# Altium project 6S_4V-8V_OS3_V4.PrjPcb
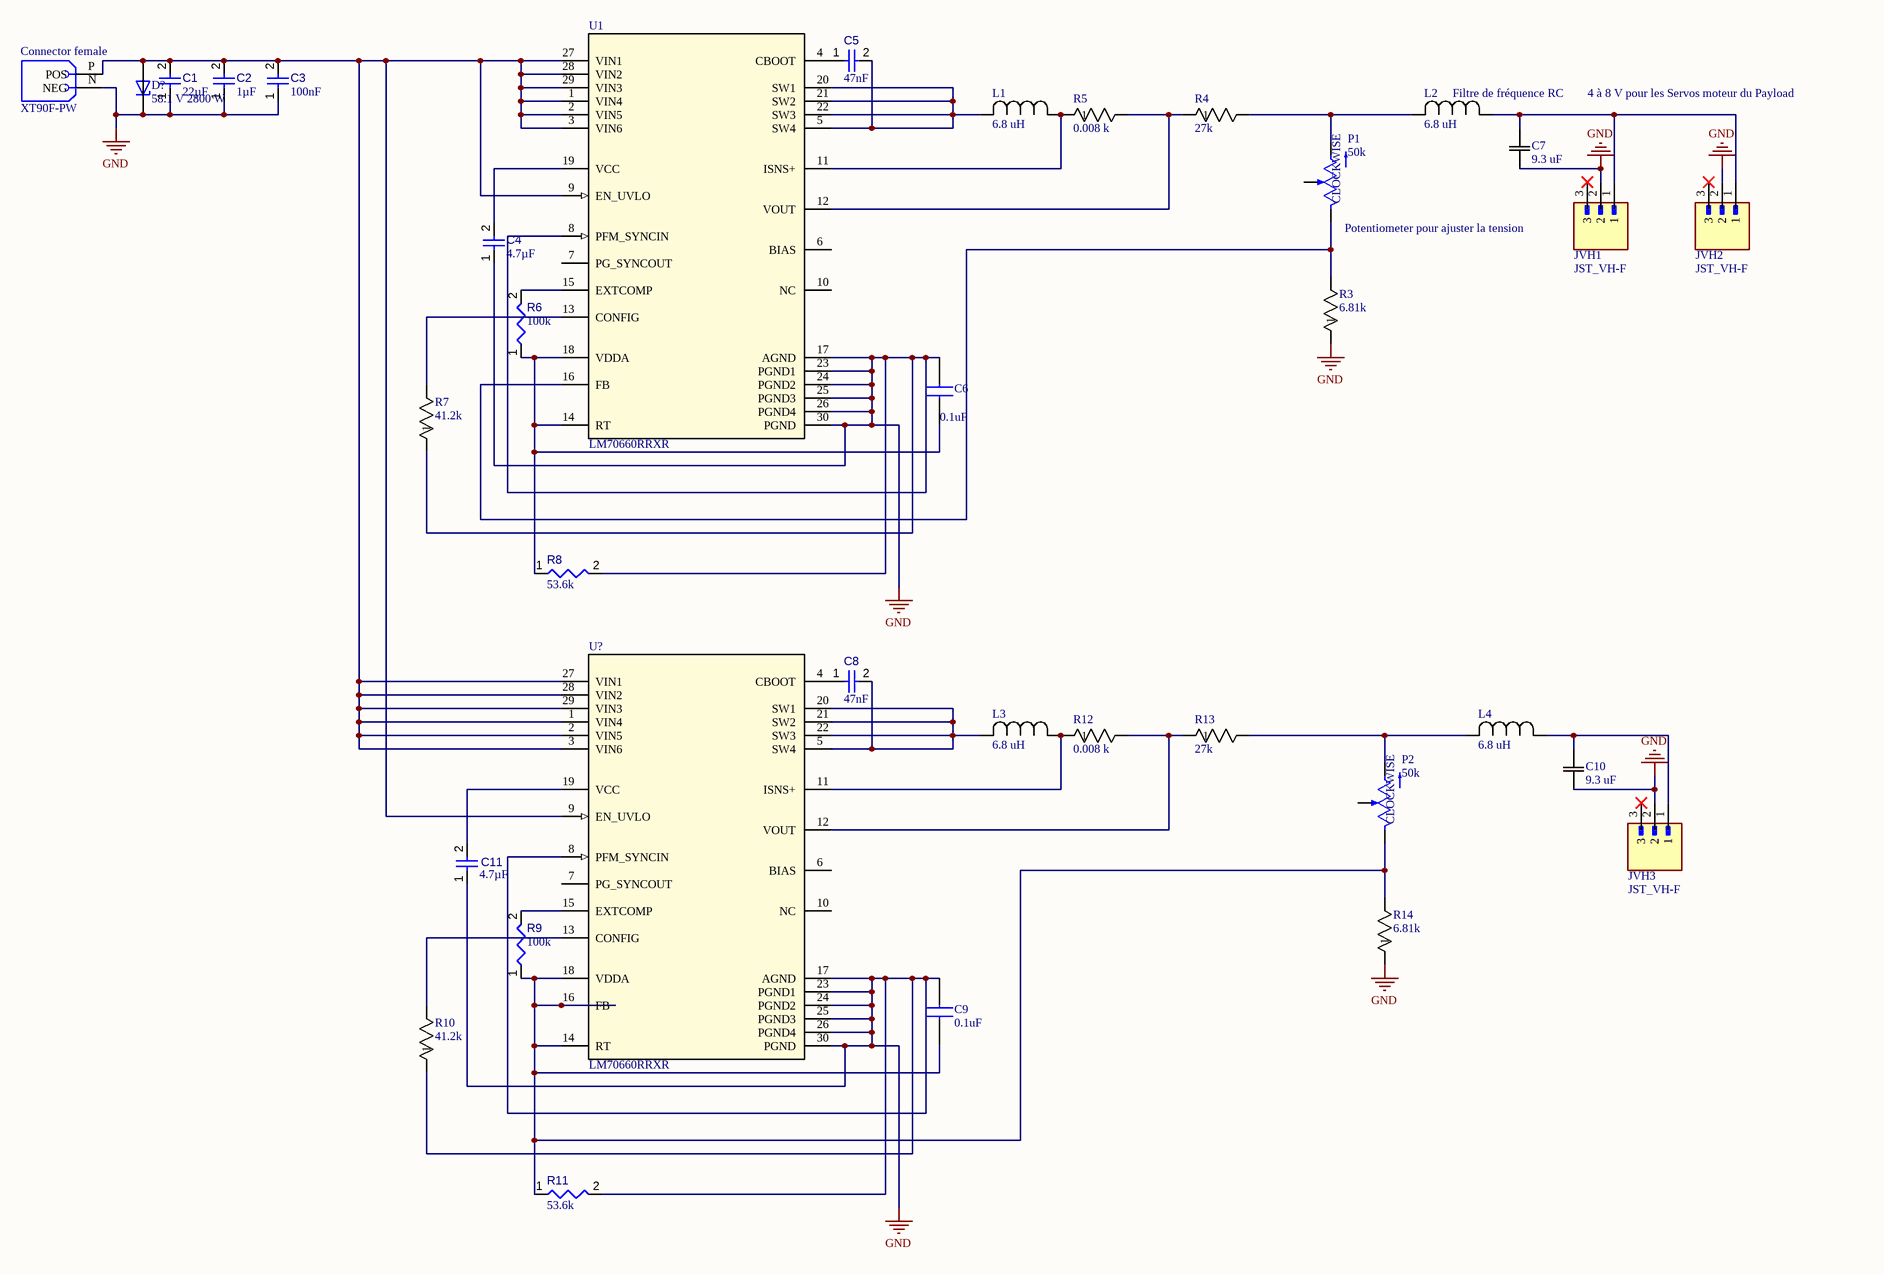
[diagram p0: 6S_4V-8V_OS3_V4.SchDoc]
1 sheet, 36 parts. Net scope: global (net labels, ports and power ports of the same name join across sheets).
Board file: PCB1.PcbDoc

## Sheet 6S_4V-8V_OS3_V4.SchDoc
size A2; SheetNumber: 1; SheetTotal: 1

### Parts
C1  value 22µF  [CAPC0805(2012)145_L]  (hidden comment: Capacitor 22µF +/-40% 16V 0805)
C2  value 1µF  [CAPC1608X94X35NL15T15]  (hidden comment: Capacitor 1 uF +/- 10% 16 V 0603)
C3  value 100nF  [CAPC1608X90X40NL10T20]  (hidden comment: Capacitor 100 nF +/-10% 50 V 0603)
C4  value 4.7µF  [CAPC0805(2012)145_L]  (hidden comment: Capacitor 4.7µF +/-40% 25V 0805)
C5  value 47nF  [CAPC0402(1005)60_L]  (hidden comment: Capacitor 47nF +/-20% 50V 0402)
C6  0.1uF  [CAPC2012X145N]
C7  9.3 uF  [CAP_1812C_X7R_2S_50V_KEM]
C8  value 47nF  [CAPC0402(1005)60_L]  (hidden comment: Capacitor 47nF +/-20% 50V 0402)
C9  0.1uF  [CAPC2012X145N]
C10  9.3 uF  [CAP_1812C_X7R_2S_50V_KEM]
C11  value 4.7µF  [CAPC0805(2012)145_L]  (hidden comment: Capacitor 4.7µF +/-40% 25V 0805)
Connector_female  XT90F-PW  [AMASS_XT90PW-F]
D?  58.1 V 2800 W  [TVSP_TLD8S36AH]
JVH1  JST_VH-F  [JST_B3P-VH(LF)(SN)]
JVH2  JST_VH-F  [JST_B3P-VH(LF)(SN)]
JVH3  JST_VH-F  [JST_B3P-VH(LF)(SN)]
L1  6.8 uH  [IND_IHLP-4040DZ_VIS]
L2  6.8 uH  [IND_IHLP-4040DZ_VIS]
L3  6.8 uH  [IND_IHLP-4040DZ_VIS]
L4  6.8 uH  [IND_IHLP-4040DZ_VIS]
P1  50k  [TRIM_3361P-1-503GLF]
P2  50k  [TRIM_3361P-1-503GLF]
R3  6.81k  [RES_MFR25_6P3X2P4_YAG]
R4  27k  [STA_CF18_STP]
R5  0.008 k  [STA_CF18_STP]
R6  value 100k  [RESC1005X40X25ML05T05]  (hidden comment: Resistor 100k +/-1% 0402 100 mW)
R7  41.2k  [YAG_MF25_YAG]
R8  value 53.6k  [RESC0402(1005)_L]  (hidden comment: Resistor 53K6 +/-1 % 0402 63 mW)
R9  value 100k  [RESC1005X40X25ML05T05]  (hidden comment: Resistor 100k +/-1% 0402 100 mW)
R10  41.2k  [YAG_MF25_YAG]
R11  value 53.6k  [RESC0402(1005)_L]  (hidden comment: Resistor 53K6 +/-1 % 0402 63 mW)
R12  0.008 k  [STA_CF18_STP]
R13  27k  [STA_CF18_STP]
R14  6.81k  [RES_MFR25_6P3X2P4_YAG]
U1  LM70660RRXR  [RRX0029B-MFG]
U?  LM70660RRXR  [RRX0029B-MFG]

### Nets
GND: C1.1 C2.1 C3.1 C4.1 C6.2 C7.1 C9.2 C10.1 C11.1 Connector_female.N(NEG) D?.C JVH1.2 JVH2.2 JVH3.2 R3.1 R7.1 R8.2 R10.1 R11.2 R14.1 U1.8(PFM_SYNCIN) U1.17(AGND) U1.23(PGND1) U1.24(PGND2) U1.25(PGND3) U1.26(PGND4) U1.30(PGND) U?.8(PFM_SYNCIN) U?.17(AGND) U?.23(PGND1) U?.24(PGND2) U?.25(PGND3) U?.26(PGND4) U?.30(PGND)
NetC1_2: C1.2 C2.2 C3.2 Connector_female.P(POS) D?.A U1.1(VIN4) U1.2(VIN5) U1.3(VIN6) U1.9(EN_UVLO) U1.27(VIN1) U1.28(VIN2) U1.29(VIN3) U?.1(VIN4) U?.2(VIN5) U?.3(VIN6) U?.9(EN_UVLO) U?.27(VIN1) U?.28(VIN2) U?.29(VIN3)
NetC4_2: C4.2 U1.19(VCC)
NetC5_1: C5.1 U1.4(CBOOT)
NetC5_2: C5.2 L1.2 U1.5(SW4) U1.20(SW1) U1.21(SW2) U1.22(SW3)
NetC6_1: C6.1 R6.1 R8.1 U1.14(RT) U1.18(VDDA)
NetC7_2: C7.2 JVH1.1 JVH2.1 L2.1
NetC8_1: C8.1 U?.4(CBOOT)
NetC8_2: C8.2 L3.2 U?.5(SW4) U?.20(SW1) U?.21(SW2) U?.22(SW3)
NetC9_1: C9.1 P2.1(CCW) R9.1 R11.1 R14.2 U?.14(RT) U?.16(FB) U?.18(VDDA)
NetC10_2: C10.2 JVH3.1 L4.1
NetC11_2: C11.2 U?.19(VCC)
NetL1_1: L1.1 R5.1 U1.11(ISNS+)
NetL2_2: L2.2 P1.3(CW) R4.2
NetL3_1: L3.1 R12.1 U?.11(ISNS+)
NetL4_2: L4.2 P2.3(CW) R13.2
NetP1_1: P1.1(CCW) R3.2 U1.16(FB)
NetR4_1: R4.1 R5.2 U1.12(VOUT)
NetR6_2: R6.2 U1.15(EXTCOMP)
NetR7_2: R7.2 U1.13(CONFIG)
NetR9_2: R9.2 U?.15(EXTCOMP)
NetR10_2: R10.2 U?.13(CONFIG)
NetR12_2: R12.2 R13.1 U?.12(VOUT)

Not connected (* = marked no-connect by the designer): JVH1 3*; JVH2 3*; JVH3 3*; P1 2(WIPER); P2 2(WIPER); U1 6(BIAS) 7(PG_SYNCOUT) 10(NC); U? 6(BIAS) 7(PG_SYNCOUT) 10(NC)

### Notes on the sheet
- (near L2) Filtre de fréquence RC
- 4 à 8 V pour les Servos moteur du Payload
- Potentiometer pour ajuster la tension
- (in symbol TRIM_3361P-1-503GLF) CLOCKWISE

### Library data of the parts
C1 = CMP-001-00081-4: Chip Capacitor, 22µF +/-40%, 16V, 0805, Thickness 1.45 mm; Tolerance: 5%; Voltage Rating: 16V; Mounting Technology: SMT; Pins: 2; Max Operating Temperature: 85°C; Case/Package: 0805; Min Operating Temperature: -55°C
C2 = CMP-001-00003-6: Chip Capacitor, 1 uF, +/- 10%, 16 V, 0603 (1608 Metric); Voltage Rating: 16V; Capacitor Type: Ceramic; Max Operating Temperature: 125°C; Pins: 2; Tolerance: 10%; Min Operating Temperature: -55°C; RoHS Compliant: True; Mounting Technology: SM; Case/Package: 0603
C3 = CMP-001-00017-6: Chip Capacitor, 100 nF, +/- 10%, 50 V, 0603 (1608 Metric); Voltage Rating: 50V; Capacitor Type: Ceramic; Tolerance: 10%; Mounting Technology: SM; Max Operating Temperature: 125°C; RoHS Compliant: True; Pins: 2; Case/Package: 0603; Min Operating Temperature: -55°C
C4 C11 = CMP-001-00080-4: Chip Capacitor, 4.7µF +/-40%, 25V, 0805, Thickness 1.45 mm; Tolerance: 20%; Voltage Rating: 25V; Min Operating Temperature: -55°C; Max Operating Temperature: 85°C; Pins: 2; Mounting Technology: SMT; Case/Package: 0805
C5 C8 = CMP-001-00071-4: Chip Capacitor, 47nF +/-20%, 50V, 0402, Thickness 0.6 mm; Tolerance: 20%; Pins: 2; Mounting Technology: SMT; Voltage Rating: 50V; Case/Package: 0402; Max Operating Temperature: 85°C; Min Operating Temperature: -55°C
C6 C9 = C2012X7R2A104K125AA: Capacitor; Manufacturer_Name: TDK; Datasheet Link: https://product.tdk.com/info/en/catalog/datasheets/mlcc_commercial_midvoltage_en.pdf; Height: 1.45mm; Manufacturer_Part_Number: C2012X7R2A104K125AA; Mouser Part Number: 810-C2012X7R2A104K; Mouser Price/Stock: https://www.mouser.co.uk/ProductDetail/TDK/C2012X7R2A104K125AA?qs=NRhsANhppD9J0ZsT2%2Fo%2F7Q%3D%3D; Arrow Part Number: C2012X7R2A104K125AA; Arrow Price/Stock: https://www.arrow.com/en/products/c2012x7r2a104k125aa/tdk?region=europe; ClassName: PowerModul
C7 C10 = CAP_1812C_X7R_2S_50V_KEM: Capacitor 9.3 uF; ComponentLink1Description: Manufacturer Link; ComponentLink1URL: https://www.digikey.ca/en/products/detail/kemet/C1812C945K5RLCAUTO/13146940
D? = TVSP_TLD8S36AH: Diode TVS 2800 W Unidirectionnelle; ComponentLink1Description: Manufacturer Link; ComponentLink1URL: https://www.digikey.ca/en/products/detail/taiwan-semiconductor-corporation/TLD5S36AH/9659228
L1-L4 = IHLP4040DZER6R8M11: Inductance 6.8uF 7.5V Isat; ComponentLink1Description: Manufacturer Link; ComponentLink1URL: https://www.digikey.ca/en/products/detail/vishay-dale/IHLP4040DZER6R8M11/1220708
P1 P2 = TRIM_3361P-1-503GLF: Potentiometer 50k ohms; ComponentLink1Description: Manufacturer Link; ComponentLink1URL: https://www.digikey.ca/en/products/detail/bourns-inc/3361P-1-503GLF/1088375
R3 R14 = Resistor_6.81k: ComponentLink1Description: Link; ComponentLink1URL: https://www.digikey.ca/fr/products/detail/yageo/MFR-25FRF52-6K81/14969
R4 R13 = STA_CF18_STP: Resistor 27k ohms; ComponentLink1Description: Manufacturer Link; ComponentLink1URL: https://www.digikey.ca/en/models/1741656?tab=ultralibrarian
R5 R12 = STA_CF18_STP_1: Resistor 8 mOhms; ComponentLink1Description: Manufacturer Link; ComponentLink1URL: https://www.digikey.ca/en/products/detail/ohmite/14AFR008E/2003850
R6 R9 = CMP-009-00022-5: Chip Resistor, 100 KOhm, +/- 1%, 0.1 W, -55 to 155 degC, 0402 (1005 Metric); Power: 100mW; Voltage Rating: 50V; Mounting Technology: SM; Pins: 2; Min Operating Temperature: -55°C; Tolerance: 1%; RoHS Compliant: True; Case/Package: 0402; Max Operating Temperature: 155°C
R7 R10 = YAG_MF25_YAG: Resistor 41.2k Through Hole; ComponentLink1Description: Manufacturer Link; ComponentLink1URL: https://www.digikey.ca/fr/products/detail/yageo/MFR-25FBF52-41K2/13398
R8 R11 = CMP-009-00124-3: Chip Resistor, 53,6 kOhms, +/-1 %, 63 mW, -55 to 155 degC, 0402; Power: 63mW; Tolerance: 1%; Case/Package: 0402; Min Operating Temperature: -55°C; Pins: 2; Max Operating Temperature: 155°C
U1 U? = LM70660RRXR: High-density, 4.5V to 65V input, 6A low-EMI synchronous DC/DC step-down converter 29-VQFN -40 to 150; Manufacturer_Name: Texas Instruments; TYPE: TYPE; RefDes: RefDes; Copyright: Copyright (C) 2025 Ultra Librarian. All rights reserved.; Manufacturer_Part_Number: LM70660RRXR